# Altium schematic sheet cell_inputfilter.SchDoc
size A4 portrait; SheetNumber: 2; SheetTotal: 10
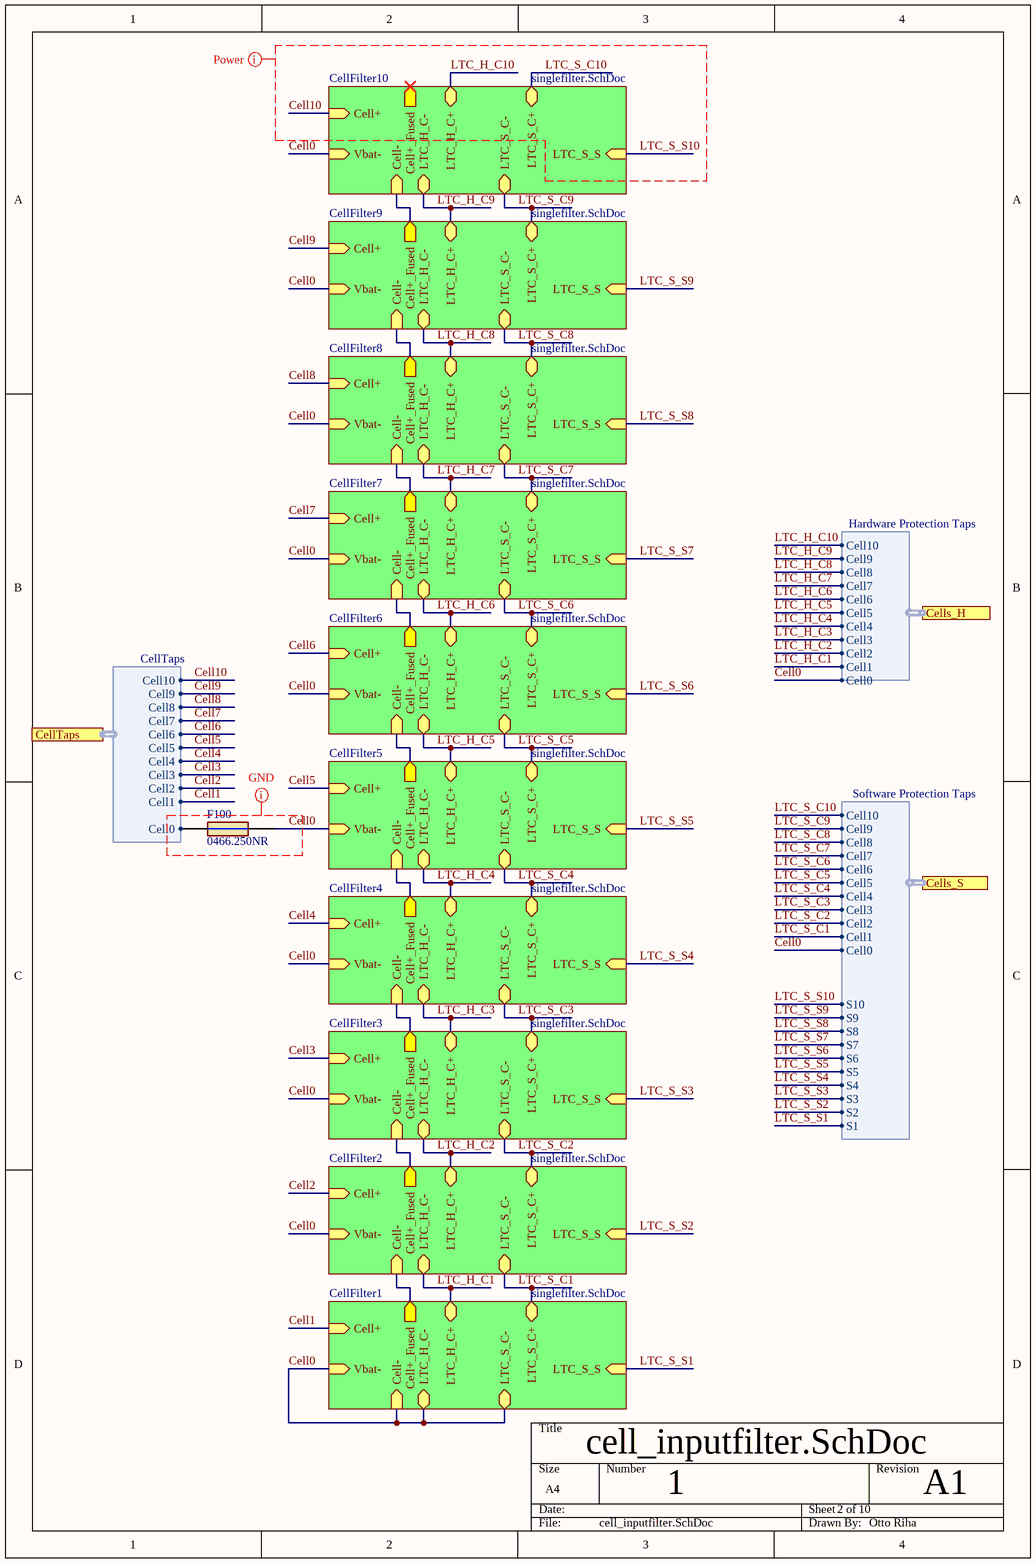
[diagram p0: cell_inputfilter.SchDoc]

## Parts
F100  0466.250NR  [FUSC3215X66N]

## Sub-sheets
CellFilter1 = singlefilter.SchDoc: Cell+ (in), Cell- (in), Vbat- (in), LTC_S_C+ (bidir), LTC_H_C+ (bidir), LTC_H_C- (bidir), LTC_S_C- (bidir), LTC_S_S (in), Cell+_Fused (out)
CellFilter2 = singlefilter.SchDoc: Cell+ (in), Cell- (in), Vbat- (in), LTC_S_C+ (bidir), LTC_H_C+ (bidir), LTC_H_C- (bidir), LTC_S_C- (bidir), LTC_S_S (in), Cell+_Fused (out)
CellFilter3 = singlefilter.SchDoc: Cell+ (in), Cell- (in), Vbat- (in), LTC_S_C+ (bidir), LTC_H_C+ (bidir), LTC_H_C- (bidir), LTC_S_C- (bidir), LTC_S_S (in), Cell+_Fused (out)
CellFilter4 = singlefilter.SchDoc: Cell+ (in), Cell- (in), Vbat- (in), LTC_S_C+ (bidir), LTC_H_C+ (bidir), LTC_H_C- (bidir), LTC_S_C- (bidir), LTC_S_S (in), Cell+_Fused (out)
CellFilter5 = singlefilter.SchDoc: Cell+ (in), Cell- (in), Vbat- (in), LTC_S_C+ (bidir), LTC_H_C+ (bidir), LTC_H_C- (bidir), LTC_S_C- (bidir), LTC_S_S (in), Cell+_Fused (out)
CellFilter6 = singlefilter.SchDoc: Cell+ (in), Cell- (in), Vbat- (in), LTC_S_C+ (bidir), LTC_H_C+ (bidir), LTC_H_C- (bidir), LTC_S_C- (bidir), LTC_S_S (in), Cell+_Fused (out)
CellFilter7 = singlefilter.SchDoc: Cell+ (in), Cell- (in), Vbat- (in), LTC_S_C+ (bidir), LTC_H_C+ (bidir), LTC_H_C- (bidir), LTC_S_C- (bidir), LTC_S_S (in), Cell+_Fused (out)
CellFilter8 = singlefilter.SchDoc: Cell+ (in), Cell- (in), Vbat- (in), LTC_S_C+ (bidir), LTC_H_C+ (bidir), LTC_H_C- (bidir), LTC_S_C- (bidir), LTC_S_S (in), Cell+_Fused (out)
CellFilter9 = singlefilter.SchDoc: Cell+ (in), Cell- (in), Vbat- (in), LTC_S_C+ (bidir), LTC_H_C+ (bidir), LTC_H_C- (bidir), LTC_S_C- (bidir), LTC_S_S (in), Cell+_Fused (out)
CellFilter10 = singlefilter.SchDoc: Cell+ (in), Cell- (in), Vbat- (in), LTC_S_C+ (bidir), LTC_H_C+ (bidir), LTC_H_C- (bidir), LTC_S_C- (bidir), LTC_S_S (in), Cell+_Fused (out)

## Ports
Cells_H (harness Hardware Protection Taps, see Main[4C]), Cells_S (harness Software Protection Taps, see Main[4C]), CellTaps (harness CellTaps, see Main[3C])

## Harnesses
CellTaps: Cell9, Cell10, Cell0, Cell1, Cell2, Cell3, Cell4, Cell5, Cell6, Cell7, Cell8
Hardware Protection Taps: Cell0, Cell1, Cell2, Cell3, Cell4, Cell5, Cell6, Cell7, Cell8, Cell9, Cell10
Software Protection Taps: Cell0, Cell1, Cell2, Cell3, Cell4, Cell5, Cell6, Cell7, Cell8, Cell9, Cell10, S1, S2, S3, S4, S5, S6, S7, S8, S9, S10

## Nets
Cell0: F100.2 ; sheet CellFilter1/Cell-, sheet CellFilter1/Vbat-, sheet CellFilter1/LTC_H_C-, sheet CellFilter1/LTC_S_C-, sheet CellFilter2/Vbat-, sheet CellFilter3/Vbat-, sheet CellFilter4/Vbat-, sheet CellFilter5/Vbat-, sheet CellFilter6/Vbat-, sheet CellFilter7/Vbat-, sheet CellFilter8/Vbat-, sheet CellFilter9/Vbat-, sheet CellFilter10/Vbat-, port Cells_H.Cell0, port Cells_S.Cell0
Cell1: sheet CellFilter1/Cell+, port CellTaps.Cell1
Cell2: sheet CellFilter2/Cell+, port CellTaps.Cell2
Cell3: sheet CellFilter3/Cell+, port CellTaps.Cell3
Cell4: sheet CellFilter4/Cell+, port CellTaps.Cell4
Cell5: sheet CellFilter5/Cell+, port CellTaps.Cell5
Cell6: sheet CellFilter6/Cell+, port CellTaps.Cell6
Cell7: sheet CellFilter7/Cell+, port CellTaps.Cell7
Cell8: sheet CellFilter8/Cell+, port CellTaps.Cell8
Cell9: sheet CellFilter9/Cell+, port CellTaps.Cell9
Cell10: sheet CellFilter10/Cell+, port CellTaps.Cell10
LTC_H_C1: sheet CellFilter1/LTC_H_C+, sheet CellFilter2/LTC_H_C-, port Cells_H.Cell1
LTC_H_C2: sheet CellFilter2/LTC_H_C+, sheet CellFilter3/LTC_H_C-, port Cells_H.Cell2
LTC_H_C3: sheet CellFilter3/LTC_H_C+, sheet CellFilter4/LTC_H_C-, port Cells_H.Cell3
LTC_H_C4: sheet CellFilter4/LTC_H_C+, sheet CellFilter5/LTC_H_C-, port Cells_H.Cell4
LTC_H_C5: sheet CellFilter5/LTC_H_C+, sheet CellFilter6/LTC_H_C-, port Cells_H.Cell5
LTC_H_C6: sheet CellFilter6/LTC_H_C+, sheet CellFilter7/LTC_H_C-, port Cells_H.Cell6
LTC_H_C7: sheet CellFilter7/LTC_H_C+, sheet CellFilter8/LTC_H_C-, port Cells_H.Cell7
LTC_H_C8: sheet CellFilter8/LTC_H_C+, sheet CellFilter9/LTC_H_C-, port Cells_H.Cell8
LTC_H_C9: sheet CellFilter9/LTC_H_C+, sheet CellFilter10/LTC_H_C-, port Cells_H.Cell9
LTC_H_C10: sheet CellFilter10/LTC_H_C+, port Cells_H.Cell10
LTC_S_C1: sheet CellFilter1/LTC_S_C+, sheet CellFilter2/LTC_S_C-, port Cells_S.Cell1
LTC_S_C2: sheet CellFilter2/LTC_S_C+, sheet CellFilter3/LTC_S_C-, port Cells_S.Cell2
LTC_S_C3: sheet CellFilter3/LTC_S_C+, sheet CellFilter4/LTC_S_C-, port Cells_S.Cell3
LTC_S_C4: sheet CellFilter4/LTC_S_C+, sheet CellFilter5/LTC_S_C-, port Cells_S.Cell4
LTC_S_C5: sheet CellFilter5/LTC_S_C+, sheet CellFilter6/LTC_S_C-, port Cells_S.Cell5
LTC_S_C6: sheet CellFilter6/LTC_S_C+, sheet CellFilter7/LTC_S_C-, port Cells_S.Cell6
LTC_S_C7: sheet CellFilter7/LTC_S_C+, sheet CellFilter8/LTC_S_C-, port Cells_S.Cell7
LTC_S_C8: sheet CellFilter8/LTC_S_C+, sheet CellFilter9/LTC_S_C-, port Cells_S.Cell8
LTC_S_C9: sheet CellFilter9/LTC_S_C+, sheet CellFilter10/LTC_S_C-, port Cells_S.Cell9
LTC_S_C10: sheet CellFilter10/LTC_S_C+, port Cells_S.Cell10
LTC_S_S1: sheet CellFilter1/LTC_S_S, port Cells_S.S1
LTC_S_S2: sheet CellFilter2/LTC_S_S, port Cells_S.S2
LTC_S_S3: sheet CellFilter3/LTC_S_S, port Cells_S.S3
LTC_S_S4: sheet CellFilter4/LTC_S_S, port Cells_S.S4
LTC_S_S5: sheet CellFilter5/LTC_S_S, port Cells_S.S5
LTC_S_S6: sheet CellFilter6/LTC_S_S, port Cells_S.S6
LTC_S_S7: sheet CellFilter7/LTC_S_S, port Cells_S.S7
LTC_S_S8: sheet CellFilter8/LTC_S_S, port Cells_S.S8
LTC_S_S9: sheet CellFilter9/LTC_S_S, port Cells_S.S9
LTC_S_S10: sheet CellFilter10/LTC_S_S, port Cells_S.S10
NetF100_1: F100.1 ; port CellTaps.Cell0
(unnamed): sheet CellFilter1/Cell+_Fused, sheet CellFilter2/Cell-
(unnamed): sheet CellFilter2/Cell+_Fused, sheet CellFilter3/Cell-
(unnamed): sheet CellFilter3/Cell+_Fused, sheet CellFilter4/Cell-
(unnamed): sheet CellFilter4/Cell+_Fused, sheet CellFilter5/Cell-
(unnamed): sheet CellFilter5/Cell+_Fused, sheet CellFilter6/Cell-
(unnamed): sheet CellFilter6/Cell+_Fused, sheet CellFilter7/Cell-
(unnamed): sheet CellFilter7/Cell+_Fused, sheet CellFilter8/Cell-
(unnamed): sheet CellFilter8/Cell+_Fused, sheet CellFilter9/Cell-
(unnamed): sheet CellFilter9/Cell+_Fused, sheet CellFilter10/Cell-

## Layout directives
net class Batt+: Cell10, LTC_H_C10, LTC_S_C10, LTC_S_S10
net class GND: Cell0

## Notes on the sheet
- 1
- A1
- Otto Riha

## Library data of the parts
F100 = 0466.250NR: Fuse; Manufacturer_Name: LITTELFUSE; Datasheet Link: http://www.littelfuse.com/~/media/electronics/datasheets/fuses/littelfuse_fuse_466_datasheet.pdf.pdf; Height: 0.66mm; Manufacturer_Part_Number: 0466.250NR; Mouser Part Number: 576-0466.250NR; Mouser Price/Stock: https://www.mouser.co.uk/ProductDetail/Littelfuse/0466.250NR?qs=OJFHm2hVE4FeDcEECJ4GEQ%3D%3D; Arrow Part Number: 0466.250NR; Arrow Price/Stock: https://www.arrow.com/en/products/0466.250nr/littelfuse?region=nac